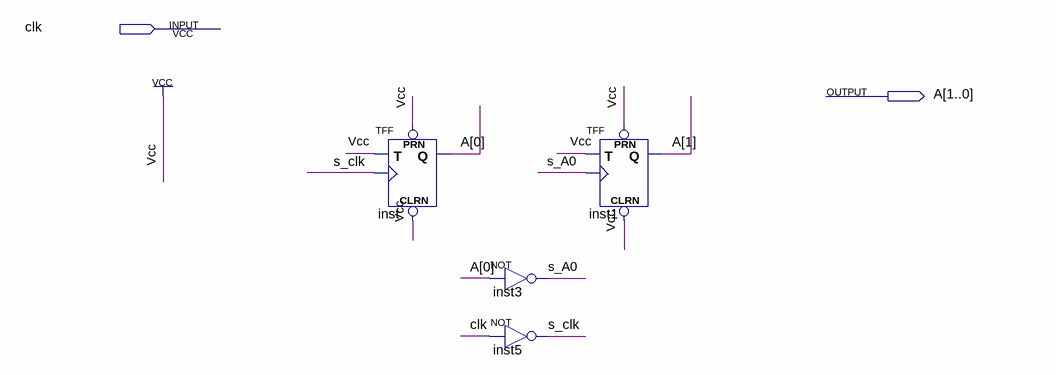
[diagram p0: schematic sheet]
// Quartus schematic contador.bdf as structural Verilog: 4 symbols, 2 pins
module contador (
  input  clk,
  output [1:0] A
);

  wire s_A0, s_clk;

  TFF inst (.PRN(1'b1), .CLRN(1'b1), .T(1'b1), .CLK(s_clk), .Q(A[0]));
  not inst3 (s_A0, A[0]);
  not inst5 (s_clk, clk);
  TFF inst1 (.PRN(1'b1), .CLRN(1'b1), .T(1'b1), .CLK(s_A0), .Q(A[1]));
endmodule
